# EAGLE schematic MOTOR_DRIVER (EAGLE 8.0.1)

## Sheet 1 of 4: Motor Driver Schematic
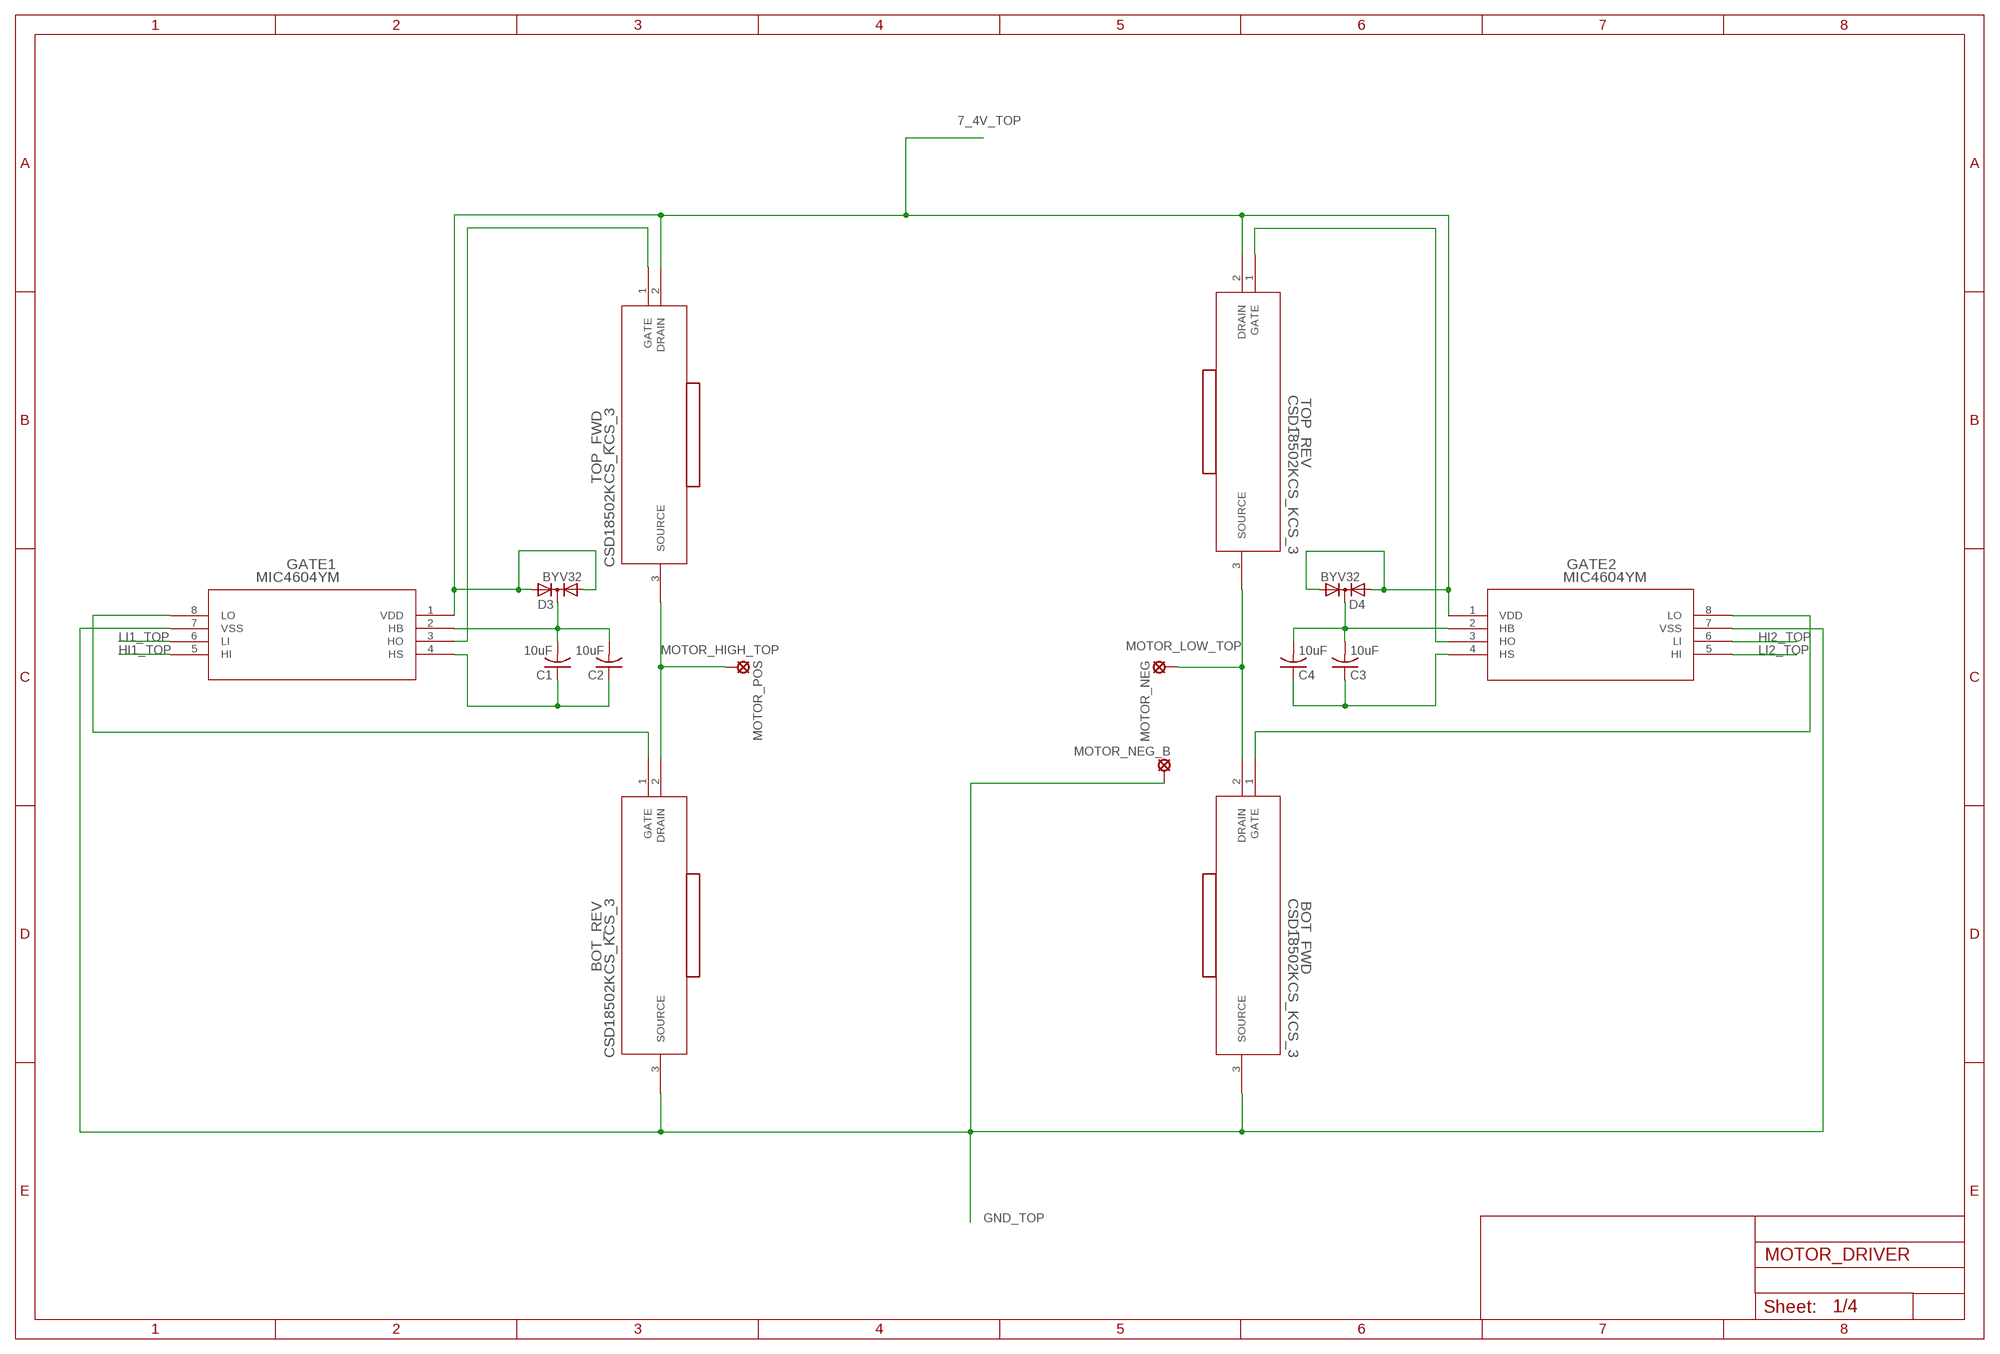
[diagram p0: schematic, sheet 1]

### Parts
BOT_FWD  CSD18502KCS_KCS_3  [KCS3]
BOT_REV  CSD18502KCS_KCS_3  [KCS3]
C1  10uF  C-US025-050X050  [C025-050X050]
C2  10uF  C-US025-050X050  [C025-050X050]
C3  10uF  C-US025-050X050  [C025-050X050]
C4  10uF  C-US025-050X050  [C025-050X050]
D3  BYV32  [TO220ABS]
D4  BYV32  [TO220ABS]
GATE1  MIC4604YM  [SOIC-8_M]
GATE2  MIC4604YM  [SOIC-8_M]
MOTOR_NEG  SE14  [SE14]
MOTOR_NEG_B  SE14  [SE14]
MOTOR_POS  SE14  [SE14]
TOP_FWD  CSD18502KCS_KCS_3  [KCS3]
TOP_REV  CSD18502KCS_KCS_3  [KCS3]
U$2  HEATSINK  [HEATSINK]
U$4  HEATSINK  [HEATSINK]
U$5  HEATSINK  [HEATSINK]
U$6  HEATSINK  [HEATSINK]

### Nets
7_4V_TOP: D3.A1 D3.A2 D4.A1 D4.A2 GATE1.1(VDD) GATE2.1(VDD) TOP_FWD.2(DRAIN) TOP_REV.2(DRAIN) ; also sheet 3,4
GND_TOP: BOT_FWD.3(SOURCE) BOT_REV.3(SOURCE) GATE1.7(VSS) GATE2.7(VSS) MOTOR_NEG_B.MP ; also sheet 3,4
HI1_TOP: GATE1.5(HI) ; also sheet 3
HI2_TOP: GATE2.6(LI) ; also sheet 3
LI1_TOP: GATE1.6(LI) ; also sheet 3
LI2_TOP: GATE2.5(HI) ; also sheet 3
MOTOR_HIGH_TOP: BOT_REV.2(DRAIN) MOTOR_POS.MP TOP_FWD.3(SOURCE) ; also sheet 3
MOTOR_LOW_TOP: BOT_FWD.2(DRAIN) MOTOR_NEG.MP TOP_REV.3(SOURCE) ; also sheet 3
N$2: BOT_REV.1(GATE) GATE1.8(LO)
N$3: GATE1.3(HO) TOP_FWD.1(GATE)
N$4: C1.1 C2.1 GATE1.4(HS)
N$5: C1.2 C2.2 D3.C GATE1.2(HB)
N$9: BOT_FWD.1(GATE) GATE2.8(LO)
N$10: GATE2.3(HO) TOP_REV.1(GATE)
N$11: C3.1 C4.1 GATE2.4(HS)
N$12: C3.2 C4.2 D4.C GATE2.2(HB)

## Sheet 2 of 4: Microcontroller schematic
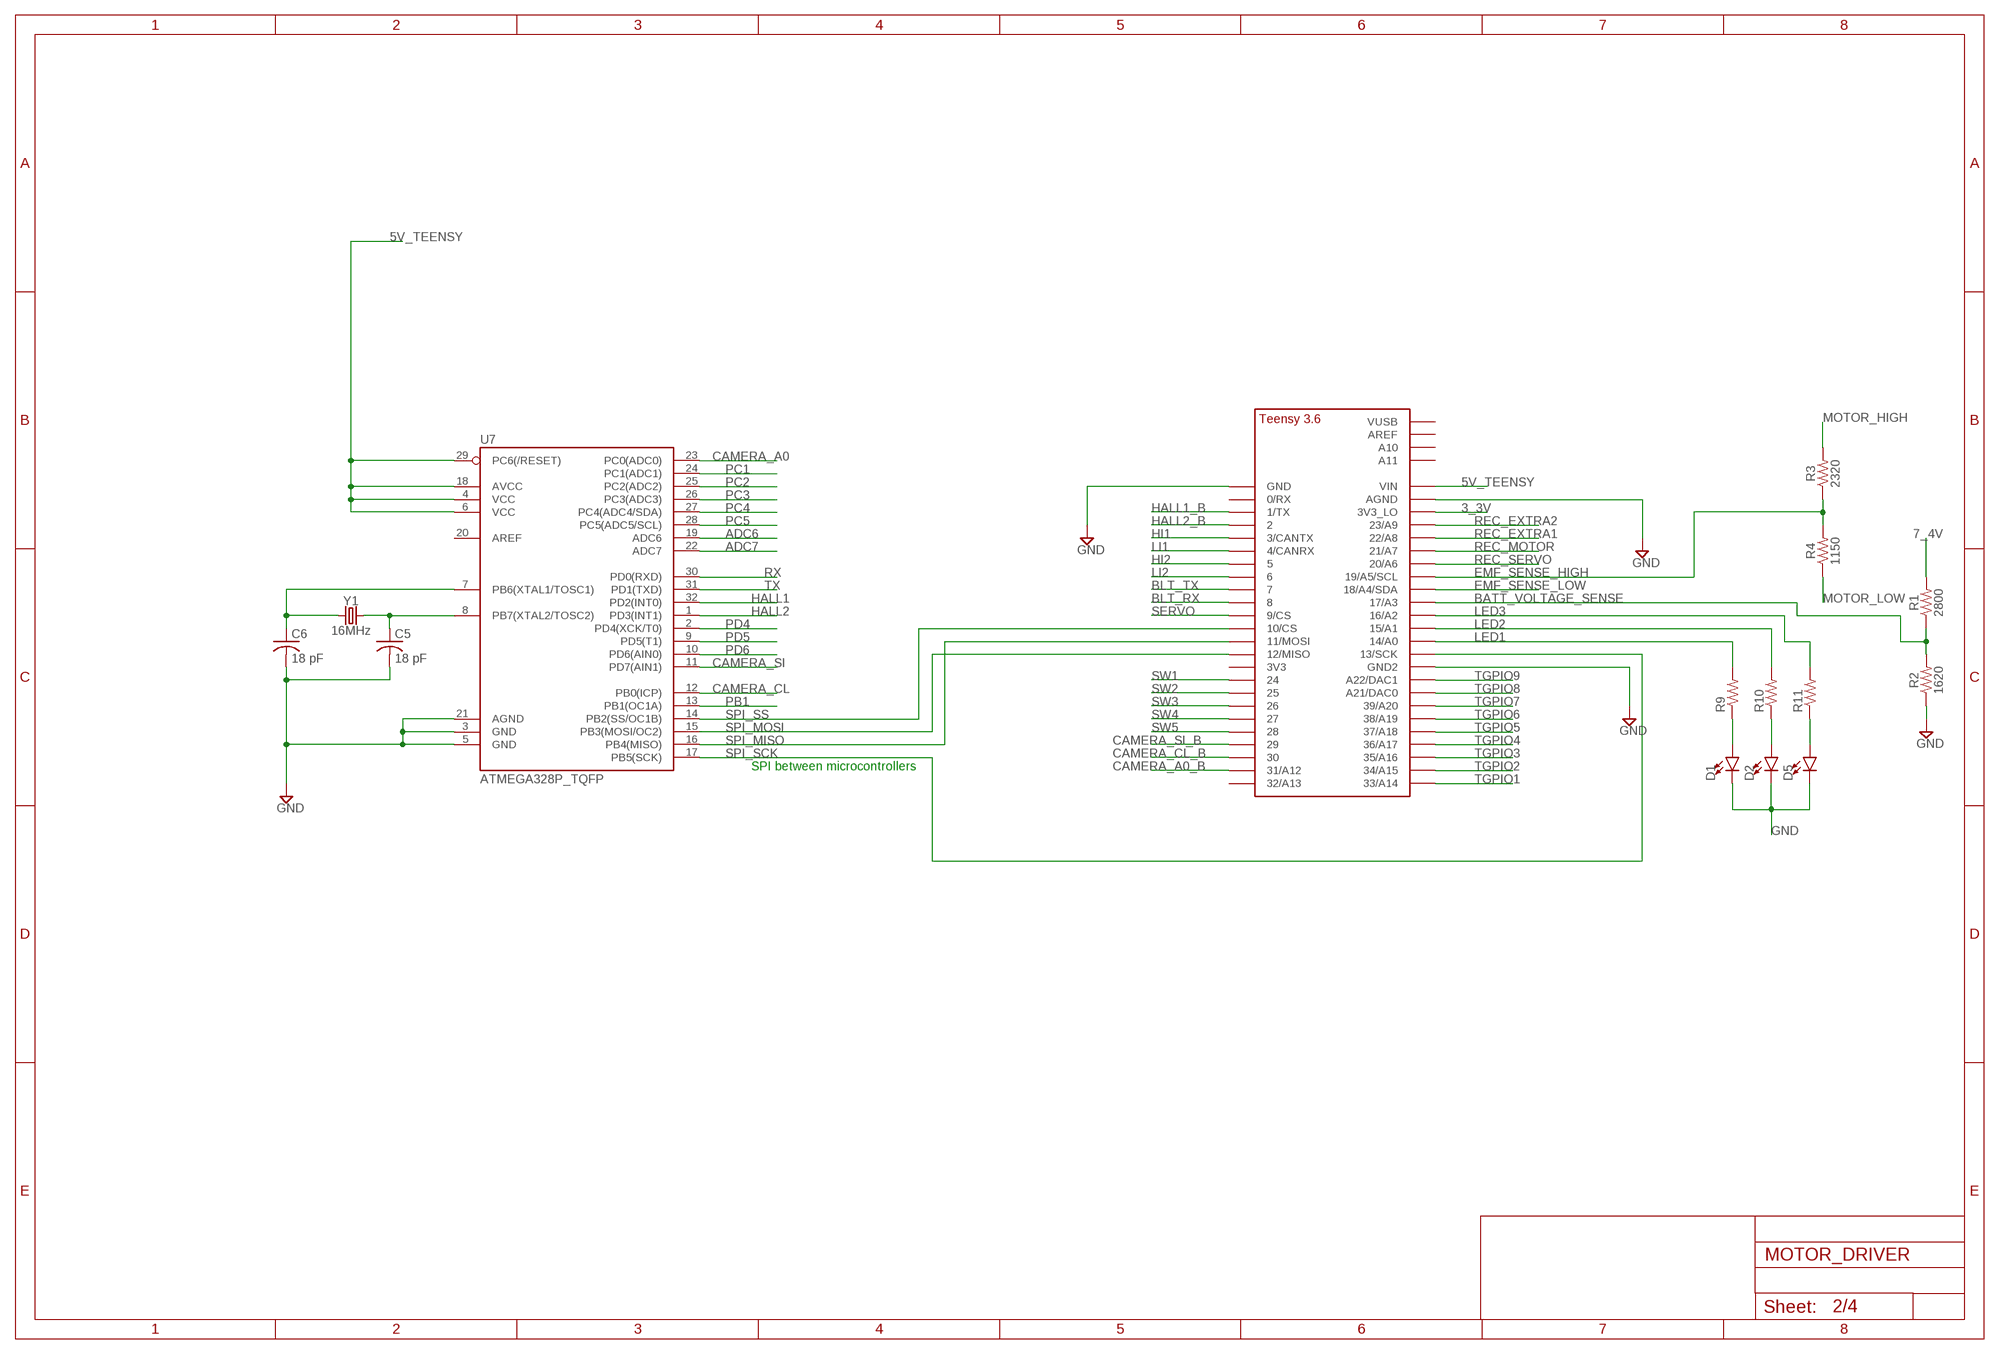
[diagram p1: schematic, sheet 2]

### Parts
C5  18 pF  C-US025-024X044  [C025-024X044]
C6  18 pF  C-US025-024X044  [C025-024X044]
D1  LED0603  [LED-0603]
D2  LED0603  [LED-0603]
D5  LED0603  [LED-0603]
R1  2800  0.3OHM-0805-1/8W-1%  [0805]
R2  1620  0.3OHM-0805-1/8W-1%  [0805]
R3  2320  0.3OHM-0805-1/8W-1%  [0805]
R4  1150  0.3OHM-0805-1/8W-1%  [0805]
R9  R-US_R0805  [R0805]
R10  R-US_R0805  [R0805]
R11  R-US_R0805  [R0805]
U7  ATMEGA328P_TQFP  [TQFP32-08]
U$1  TEENSY_3.5/3.6_BASIC  [TEENSY_3.5/3.6_BASIC]
Y1  16MHz  CRYSTAL-16MHZPTH-HC49US  [HC49US]

### Nets
3_3V: U$1.3V3_LO ; also sheet 3
5V_TEENSY: U7.4(VCC) U7.6(VCC) U7.18(AVCC) U7.29(PC6(/RESET)) U$1.VIN ; also sheet 3
7_4V: R1.2 ; also sheet 3,4
ADC6: U7.19(ADC6) ; also sheet 3
ADC7: U7.22(ADC7) ; also sheet 3
BATT_VOLTAGE_SENSE: R1.1 R2.2 U$1.17/A3
BLT_RX: U$1.8 ; also sheet 3
BLT_TX: U$1.7 ; also sheet 3
CAMERA_A0: U7.23(PC0(ADC0)) ; also sheet 3
CAMERA_A0_B: U$1.31/A12 ; also sheet 3
CAMERA_CL: U7.12(PB0(ICP)) ; also sheet 3
CAMERA_CL_B: U$1.30 ; also sheet 3
CAMERA_SI: U7.11(PD7(AIN1)) ; also sheet 3
CAMERA_SI_B: U$1.29 ; also sheet 3
EMF_SENSE_HIGH: R3.1 R4.2 U$1.19/A5/SCL
EMF_SENSE_LOW: U$1.18/A4/SDA ; also sheet 3
GND: C5.2 C6.2 D1.C D2.C D5.C R2.1 U7.3(GND) U7.5(GND) U7.21(AGND) U$1.AGND U$1.GND U$1.GND2 ; also sheet 3,4
HALL1: U7.32(PD2(INT0)) ; also sheet 3
HALL1_B: U$1.1/TX ; also sheet 3
HALL2: U7.1(PD3(INT1)) ; also sheet 3
HALL2_B: U$1.2 ; also sheet 3
HI1: U$1.3/CANTX ; also sheet 3
HI2: U$1.5 ; also sheet 3
LED1: R9.2 U$1.14/A0
LED2: R10.2 U$1.15/A1
LED3: R11.2 U$1.16/A2
LI1: U$1.4/CANRX ; also sheet 3
LI2: U$1.6 ; also sheet 3
MOTOR_HIGH: R3.2 ; also sheet 3
MOTOR_LOW: R4.1 ; also sheet 3
N$6: C6.1 U7.7(PB6(XTAL1/TOSC1)) Y1.1
N$7: C5.1 U7.8(PB7(XTAL2/TOSC2)) Y1.2
N$22: D1.A R9.1
N$23: D2.A R10.1
N$24: D5.A R11.1
PB1: U7.13(PB1(OC1A)) ; also sheet 3
PC1: U7.24(PC1(ADC1)) ; also sheet 3
PC2: U7.25(PC2(ADC2)) ; also sheet 3
PC3: U7.26(PC3(ADC3)) ; also sheet 3
PC4: U7.27(PC4(ADC4/SDA)) ; also sheet 3
PC5: U7.28(PC5(ADC5/SCL)) ; also sheet 3
PD4: U7.2(PD4(XCK/T0)) ; also sheet 3
PD5: U7.9(PD5(T1)) ; also sheet 3
PD6: U7.10(PD6(AIN0))
REC_EXTRA1: U$1.22/A8 ; also sheet 3
REC_EXTRA2: U$1.23/A9 ; also sheet 3
REC_MOTOR: U$1.21/A7 ; also sheet 3
REC_SERVO: U$1.20/A6 ; also sheet 3
RX: U7.30(PD0(RXD)) ; also sheet 3
SERVO: U$1.9/CS ; also sheet 3
SPI_MISO: U7.16(PB4(MISO)) U$1.11/MOSI
SPI_MOSI: U7.15(PB3(MOSI/OC2)) U$1.12/MISO
SPI_SCK: U7.17(PB5(SCK)) U$1.13/SCK
SPI_SS: U7.14(PB2(SS/OC1B)) U$1.10/CS
SW1: U$1.24 ; also sheet 3
SW2: U$1.25 ; also sheet 3
SW3: U$1.26 ; also sheet 3
SW4: U$1.27 ; also sheet 3
SW5: U$1.28
TGPIO1: U$1.33/A14 ; also sheet 3
TGPIO2: U$1.34/A15 ; also sheet 3
TGPIO3: U$1.35/A16 ; also sheet 3
TGPIO4: U$1.36/A17 ; also sheet 3
TGPIO5: U$1.37/A18 ; also sheet 3
TGPIO6: U$1.38/A19 ; also sheet 3
TGPIO7: U$1.39/A20 ; also sheet 3
TGPIO8: U$1.21/DAC0(A21/DAC0) ; also sheet 3
TGPIO9: U$1.A22/DAC1 ; also sheet 3
TX: U7.31(PD1(TXD)) ; also sheet 3
Unconnected: U7.20(AREF) U$1.0/RX U$1.3V3 U$1.32/A13 U$1.A10 U$1.A11 U$1.AREF U$1.VUSB

### Notes on the sheet
- SPI between microcontrollers

## Sheet 3 of 4: Header schematic
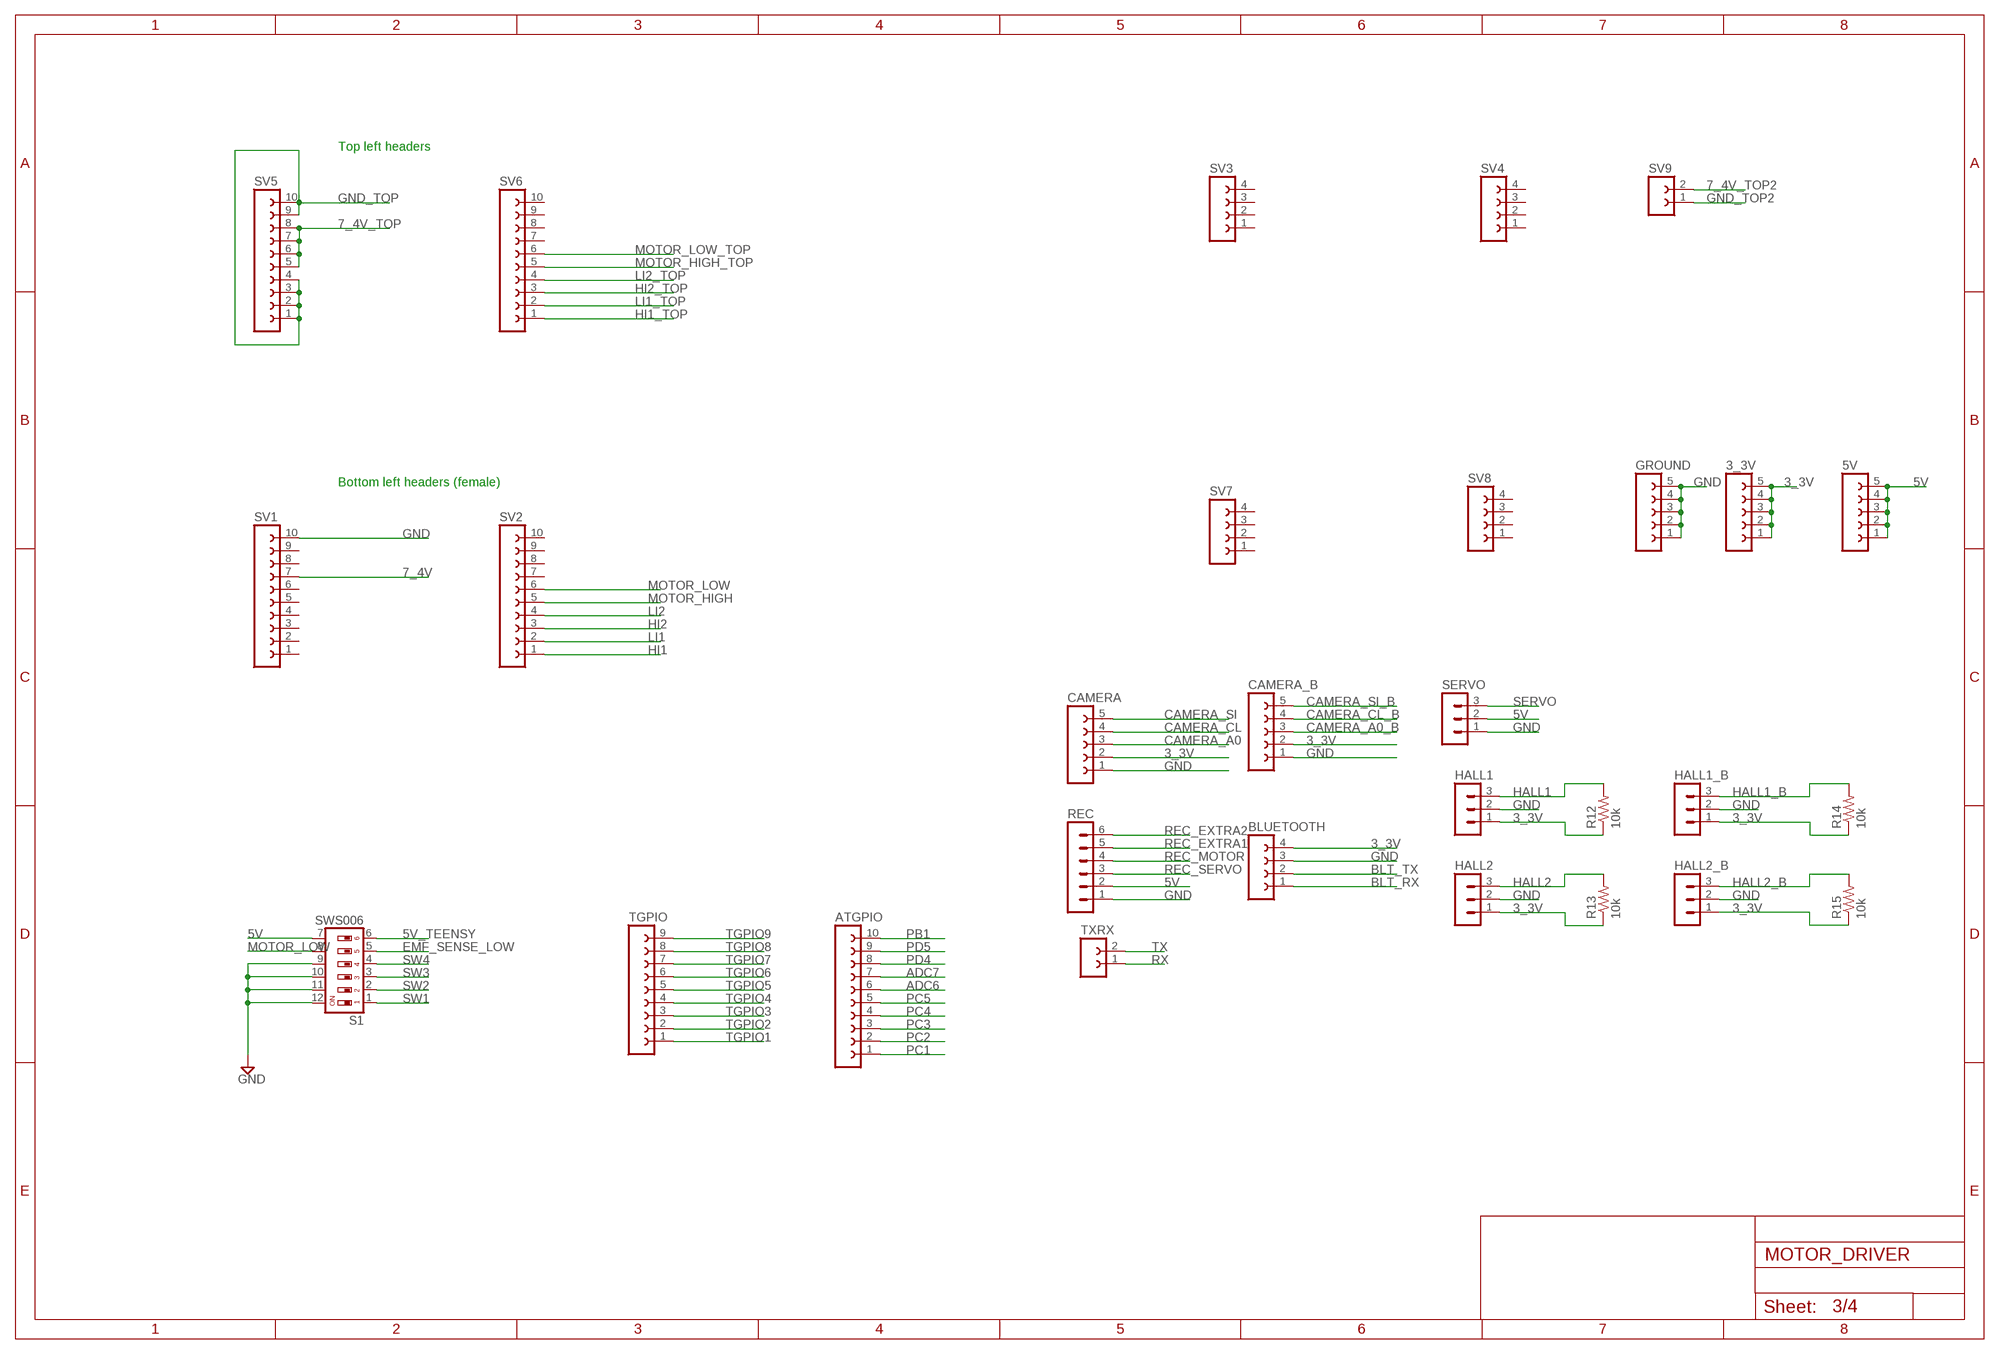
[diagram p2: schematic, sheet 3]

### Parts
3_3V  FE05-1  [FE05-1]
5V  FE05-1  [FE05-1]
ATGPIO  FE10-1  [FE10]
BLUETOOTH  FE04-1  [FE04-1]
CAMERA  FE05-1  [FE05-1]
CAMERA_B  FE05-1  [FE05-1]
GROUND  FE05-1  [FE05-1]
HALL1  MA03-1  [MA03-1]
HALL1_B  MA03-1  [MA03-1]
HALL2  MA03-1  [MA03-1]
HALL2_B  MA03-1  [MA03-1]
R12  10k  R-US_R0603  [R0603]
R13  10k  R-US_R0603  [R0603]
R14  10k  R-US_R0603  [R0603]
R15  10k  R-US_R0603  [R0603]
REC  MA06-1  [MA06-1]
S1  SWS006  [SMS-006]
SERVO  MA03-1  [MA03-1]
SV1  FE10-1  [FE10]
SV2  FE10-1  [FE10]
SV3  FE04-1  [FE04-1]
SV4  FE04-1  [FE04-1]
SV5  FE10-1  [FE10]
SV6  FE10-1  [FE10]
SV7  FE04-1  [FE04-1]
SV8  FE04-1  [FE04-1]
SV9  FE02-1  [FE02-1]
TGPIO  FE09-1  [FE09]
TXRX  FE02-1  [FE02-1]

### Nets
3_3V: 3_3V.1 3_3V.2 3_3V.3 3_3V.4 3_3V.5 BLUETOOTH.4 CAMERA.2 CAMERA_B.2 HALL1.1 HALL1_B.1 HALL2.1 HALL2_B.1 R12.1 R13.1 R14.1 R15.1 ; also sheet 2
5V: 5V.1 5V.2 5V.3 5V.4 5V.5 REC.2 S1.7 SERVO.2 ; also sheet 4
5V_TEENSY: S1.6 ; also sheet 2
7_4V: SV1.7 ; also sheet 2,4
7_4V_TOP: SV5.5 SV5.6 SV5.7 SV5.8 ; also sheet 1,4
7_4V_TOP2: SV9.2 ; also sheet 4
ADC6: ATGPIO.6 ; also sheet 2
ADC7: ATGPIO.7 ; also sheet 2
BLT_RX: BLUETOOTH.1 ; also sheet 2
BLT_TX: BLUETOOTH.2 ; also sheet 2
CAMERA_A0: CAMERA.3 ; also sheet 2
CAMERA_A0_B: CAMERA_B.3 ; also sheet 2
CAMERA_CL: CAMERA.4 ; also sheet 2
CAMERA_CL_B: CAMERA_B.4 ; also sheet 2
CAMERA_SI: CAMERA.5 ; also sheet 2
CAMERA_SI_B: CAMERA_B.5 ; also sheet 2
EMF_SENSE_LOW: S1.5 ; also sheet 2
GND: BLUETOOTH.3 CAMERA.1 CAMERA_B.1 GROUND.1 GROUND.2 GROUND.3 GROUND.4 GROUND.5 HALL1.2 HALL1_B.2 HALL2.2 HALL2_B.2 REC.1 S1.9 S1.10 S1.11 S1.12 SERVO.1 SV1.10 ; also sheet 2,4
GND_TOP: SV5.1 SV5.2 SV5.3 SV5.4 SV5.9 SV5.10 ; also sheet 1,4
GND_TOP2: SV9.1 ; also sheet 4
HALL1: HALL1.3 R12.2 ; also sheet 2
HALL1_B: HALL1_B.3 R14.2 ; also sheet 2
HALL2: HALL2.3 R13.2 ; also sheet 2
HALL2_B: HALL2_B.3 R15.2 ; also sheet 2
HI1: SV2.1 ; also sheet 2
HI1_TOP: SV6.1 ; also sheet 1
HI2: SV2.3 ; also sheet 2
HI2_TOP: SV6.3 ; also sheet 1
LI1: SV2.2 ; also sheet 2
LI1_TOP: SV6.2 ; also sheet 1
LI2: SV2.4 ; also sheet 2
LI2_TOP: SV6.4 ; also sheet 1
MOTOR_HIGH: SV2.5 ; also sheet 2
MOTOR_HIGH_TOP: SV6.5 ; also sheet 1
MOTOR_LOW: S1.8 SV2.6 ; also sheet 2
MOTOR_LOW_TOP: SV6.6 ; also sheet 1
PB1: ATGPIO.10 ; also sheet 2
PC1: ATGPIO.1 ; also sheet 2
PC2: ATGPIO.2 ; also sheet 2
PC3: ATGPIO.3 ; also sheet 2
PC4: ATGPIO.4 ; also sheet 2
PC5: ATGPIO.5 ; also sheet 2
PD4: ATGPIO.8 ; also sheet 2
PD5: ATGPIO.9 ; also sheet 2
REC_EXTRA1: REC.5 ; also sheet 2
REC_EXTRA2: REC.6 ; also sheet 2
REC_MOTOR: REC.4 ; also sheet 2
REC_SERVO: REC.3 ; also sheet 2
RX: TXRX.1 ; also sheet 2
SERVO: SERVO.3 ; also sheet 2
SW1: S1.1 ; also sheet 2
SW2: S1.2 ; also sheet 2
SW3: S1.3 ; also sheet 2
SW4: S1.4 ; also sheet 2
TGPIO1: TGPIO.1 ; also sheet 2
TGPIO2: TGPIO.2 ; also sheet 2
TGPIO3: TGPIO.3 ; also sheet 2
TGPIO4: TGPIO.4 ; also sheet 2
TGPIO5: TGPIO.5 ; also sheet 2
TGPIO6: TGPIO.6 ; also sheet 2
TGPIO7: TGPIO.7 ; also sheet 2
TGPIO8: TGPIO.8 ; also sheet 2
TGPIO9: TGPIO.9 ; also sheet 2
TX: TXRX.2 ; also sheet 2
Unconnected: SV1.1 SV1.2 SV1.3 SV1.4 SV1.5 SV1.6 SV1.8 SV1.9 SV2.7 SV2.8 SV2.9 SV2.10 SV3.1 SV3.2 SV3.3 SV3.4 SV4.1 SV4.2 SV4.3 SV4.4 SV6.7 SV6.8 SV6.9 SV6.10 SV7.1 SV7.2 SV7.3 SV7.4 SV8.1 SV8.2 SV8.3 SV8.4

### Notes on the sheet
- Top left headers
- Bottom left headers (female)

## Sheet 4 of 4: Power Schematic
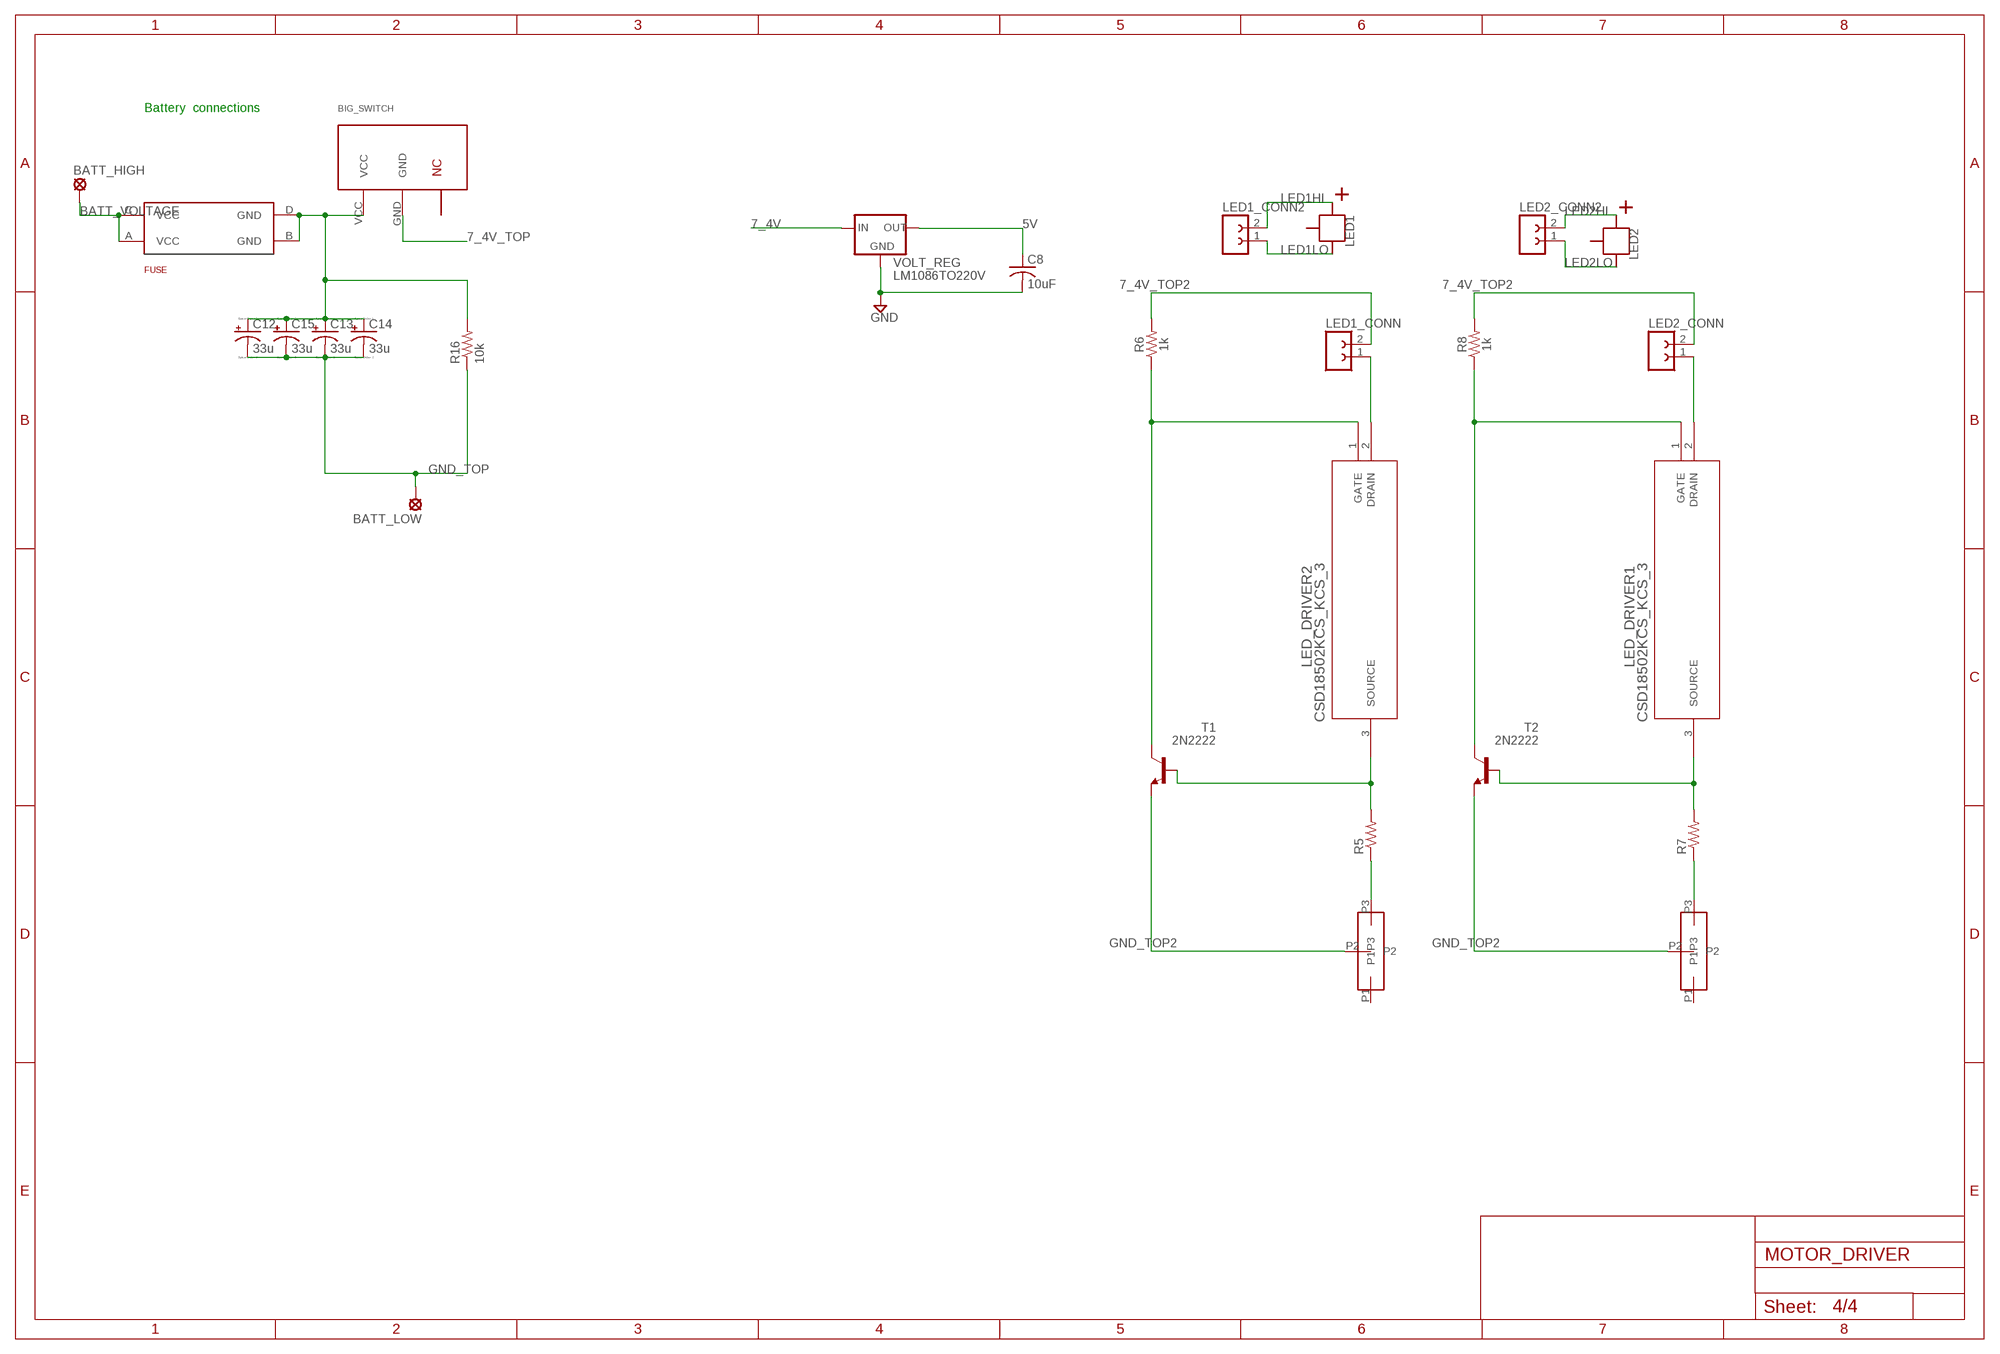
[diagram p3: schematic, sheet 4]

### Parts
BATT_HIGH  SE14  [SE14]
BATT_LOW  SE14  [SE14]
BIG_SWITCH  BIGSWITCH  [BIGSWITCH]
C8  10uF  C-US050-025X075  [C050-025X075]
C12  33u  CPOL-US153CLV-1010  [153CLV-1010]
C13  33u  CPOL-US153CLV-1010  [153CLV-1010]
C14  33u  CPOL-US153CLV-1010  [153CLV-1010]
C15  33u  CPOL-US153CLV-1010  [153CLV-1010]
FUSE  FUSEHOLDER3588  [FUSEHOLDER3588]
LED1  CREE_XP  [XP]
LED1_CONN  FE02-1  [FE02-1]
LED1_CONN2  FE02-1  [FE02-1]
LED2  CREE_XP  [XP]
LED2_CONN  FE02-1  [FE02-1]
LED2_CONN2  FE02-1  [FE02-1]
LED_DRIVER1  CSD18502KCS_KCS_3  [KCS3]
LED_DRIVER2  CSD18502KCS_KCS_3  [KCS3]
R5  R-US_R2512  [R2512]
R6  1k  1KOHM-HORIZ-1/4W-1%  [AXIAL-0.3]
R7  R-US_R2512  [R2512]
R8  1k  1KOHM-HORIZ-1/4W-1%  [AXIAL-0.3]
R16  10k  R-US_R0603  [R0603]
T1  2N2222  [TO18]
T2  2N2222  [TO18]
U$3  POT  [POT]
U$7  POT  [POT]
VOLT_REG  LM1086TO220V  [TO220S]

### Nets
5V: C8.1 VOLT_REG.2(OUT) ; also sheet 3
7_4V: VOLT_REG.3(IN) ; also sheet 2,3
7_4V_TOP: BIG_SWITCH.GND ; also sheet 1,3
7_4V_TOP2: LED1_CONN.2 LED2_CONN.2 R6.P$2 R8.P$2 ; also sheet 3
BATT_VOLTAGE: BATT_HIGH.MP FUSE.A(VCC) FUSE.C(VCC)
GND: C8.2 VOLT_REG.1(GND) ; also sheet 2,3
GND_TOP: BATT_LOW.MP C12.- C13.- C14.- C15.- R16.1 ; also sheet 1,3
GND_TOP2: T1.1(E) T2.1(E) U$3.P2 U$7.P2 ; also sheet 3
LED1HI: LED1.POSITIVE LED1.POSITIVE1(POSITIVE) LED1_CONN2.2
LED1LO: LED1.NEGATIVE LED1.NEGATIVE1(NEGATIVE) LED1_CONN2.1
LED2HI: LED2.POSITIVE LED2.POSITIVE1(POSITIVE) LED2_CONN2.2
LED2LO: LED2.NEGATIVE LED2.NEGATIVE1(NEGATIVE) LED2_CONN2.1
N$1: R5.1 U$7.P3
N$8: LED_DRIVER2.3(SOURCE) R5.2 T1.2(B)
N$13: R7.1 U$3.P3
N$16: LED_DRIVER2.1(GATE) R6.P$1 T1.3(C)
N$17: LED1_CONN.1 LED_DRIVER2.2(DRAIN)
N$18: LED_DRIVER1.3(SOURCE) R7.2 T2.2(B)
N$19: LED_DRIVER1.1(GATE) R8.P$1 T2.3(C)
N$20: LED2_CONN.1 LED_DRIVER1.2(DRAIN)
N$21: BIG_SWITCH.VCC C12.+ C13.+ C14.+ C15.+ FUSE.B(GND) FUSE.D(GND) R16.2
Unconnected: LED1.THERMAL LED2.THERMAL U$3.P1 U$7.P1

### Notes on the sheet
- Battery  connections

## Library data of the parts
3_3V 5V CAMERA CAMERA_B GROUND = con-lsta:FE05-1: FEMALE HEADER; OC_FARNELL: unknown; OC_NEWARK: unknown
ATGPIO SV1 SV2 SV5 SV6 = con-lsta:FE10-1: FEMALE HEADER; OC_FARNELL: unknown; OC_NEWARK: unknown
BATT_HIGH BATT_LOW MOTOR_NEG MOTOR_NEG_B MOTOR_POS = solpad:SE14: SOLDER PAD E1553, drill 1,4mm, distributor Buerklin, 07F820
BIG_SWITCH = bigswitch:BIGSWITCH
BLUETOOTH SV3 SV4 SV7 SV8 = con-lsta:FE04-1: FEMALE HEADER
BOT_FWD BOT_REV LED_DRIVER1 LED_DRIVER2 TOP_FWD TOP_REV = CSD18502KCS:CSD18502KCS_KCS_3; MANUFACTURER_PART_NUMBER: csd18502kcs_kcs_3; VENDOR: TEXAS INSTRUMENTS
C1-C6 C8 = resistor:C-US: CAPACITOR, American symbol
C12-C15 = resistor:CPOL-US: POLARIZED CAPACITOR, American symbol
D1 D2 D5 = SparkFun-LED:LED: LED (Generic) Standard schematic elements and footprints for 5mm, 3mm, 1206, and 0603 sized LEDs. Generic LEDs with no color specified.
D3 D4 = diode:BYV32: DIODE 2 x Si diode 200 V, 20 A/230 Apeak, 25 ns
FUSE = minifuse:FUSEHOLDER3588: Fuseholder for Keystone 3588 mini fuse
GATE1 GATE2 = MIC4604:MIC4604YM; MANUFACTURER_PART_NUMBER: mic4604ym; VENDOR: Microchip
HALL1 HALL1_B HALL2 HALL2_B SERVO = con-lstb:MA03-1: PIN HEADER; OC_FARNELL: unknown; OC_NEWARK: unknown
LED1 LED2 = Cree_XP:CREE_XP
LED1_CONN LED1_CONN2 LED2_CONN LED2_CONN2 SV9 TXRX = con-lsta:FE02-1: FEMALE HEADER
R1-R4 = SparkFun-Resistors:0.3OHM: 0.3Ω resistor A resistor is a passive two-terminal electrical component that implements electrical resistance as a circuit element. Resistors act to reduce current flow, and, at the same time, act to lower voltage levels within circuits. - Wikipedia; PROD_ID: RES-11622; VALUE: 0.3
R5 R7 R9-R11 = rcl:R-US_: RESISTOR, American symbol
R6 R8 = SparkFun-Resistors:1KOHM: 1kΩ resistor A resistor is a passive two-terminal electrical component that implements electrical resistance as a circuit element. Resistors act to reduce current flow, and, at the same time, act to lower voltage levels within circuits. - Wikipedia; PROD_ID: RES-12182
R12-R16 = resistor:R-US_: RESISTOR, American symbol
REC = con-lstb:MA06-1: PIN HEADER; OC_FARNELL: unknown; OC_NEWARK: unknown
S1 = smd-special:SWS006: SMD Dip Switch 6 pol.
T1 T2 = transistor:2N2222: NPN TRANSISTOR
TGPIO = con-lsta:FE09-1: FEMALE HEADER; OC_FARNELL: unknown; OC_NEWARK: unknown
U7 = SparkFun-IC-Microcontroller:ATMEGA328P_TQFP: Popular 328P in QFP Storefront component: ATmega328 - TQFP <https://www.sparkfun.com/products/13448> (COM-13448) Datasheet <http://www.sparkfun.com/datasheets/Components/SMD/ATMega328.pdf> SparkFun Products SparkFun RedBoard - Programmed with Arduino <https://www.sparkfun.com/products/12757> (DEV-12757) Arduino Pro Mini 328 - 5V/16MHz <https://www.sparkfun.com/products/11113> (DEV-11113) Arduino Pro Mini 328 - 3.3V/8MHz <https://www.sparkfun.com/products/11114> (DEV-11114) SparkFun OpenLog <https://www.sparkfun.com/products/13712> (DEV-13712) SparkFun MicroView - OLED Arduino Module <https://www.sparkfun.com/products/12923> (DEV-12923) SparkFun Digital Sandbox <https://www.sparkfun.com/products/12651> (DEV-12651) SparkFun PicoBoard <https://www.sparkfun.com/products/11888> (WIG-11888) Arduino Fio <https://www.sparkfun.com/products/10116> (DEV-10116) LilyPad Arduino 328 Main Board <https://www.sparkfun.com/products/13342> (DEV-13342) SparkFun RedStick <https://www.sparkfun.com/products/13741> (DEV-13741) LilyPad MP3 <https://www.sparkfun.com/products/11013> (DEV-11013) LilyPad Arduino SimpleSnap <https://www.sparkfun.com/products/10941> (DEV-10941) SparkFun Stepoko <https://www.sparkfun.com/products/13899> (ROB-13899) SparkFun Geiger Counter <https://www.sparkfun.com/products/11345> (SEN-11345) SparkFun EL Sequencer <https://www.sparkfun.com/products/12781> (COM-12781) Arduino Pro 328 - 5V/16MHz <https://www.sparkfun.com/products/10915> (DEV-10915) CryptoCape <https://www.sparkfun.com/products/12773> (DEV-12773) SparkFun IR Thermometer Evaluation Board - MLX90614 <https://www.sparkfun.com/products/10740> (SEN-10740) SparkFun RedBot Mainboard <https://www.sparkfun.com/products/12097> (ROB-12097) Arduino Pro 328 - 3.3V/8MHz <https://www.sparkfun.com/products/10914> (DEV-10914) SparkFun Block for Intel® Edison - Arduino <https://www.sparkfun.com/products/13036> (DEV-13036) SparkFun Simon Says - Surface Mount Soldering Kit <https://www.sparkfun.com/products/10935> (KIT-10935) SparkFun 7-Segment Serial Display - Red <https://www.sparkfun.com/products/11441> (COM-11441) SparkFun 7-Segment Serial Display - White <https://www.sparkfun.com/products/11629> (COM-11629) SparkFun 7-Segment Serial Display - Yellow <https://www.sparkfun.com/products/11443> (COM-11443) SparkFun 7-Segment Serial Display - Kelly Green <https://www.sparkfun.com/products/11440> (COM-11440) SparkFun 7-Segment Serial Display - Blue <https://www.sparkfun.com/products/11442> (COM-11442) SparkFun OpenSegment Serial Display - 20mm (Blue) <https://www.sparkfun.com/products/11647> (COM-11647) SparkFun OpenSegment Serial Display - 20mm (Green) <https://www.sparkfun.com/products/11646> (COM-11646) SparkFun OpenSegment Serial Display - 20mm (White) <https://www.sparkfun.com/products/11648> (COM-11648) SparkFun OpenSegment Serial Display - 20mm (Red) <https://www.sparkfun.com/products/11644> (COM-11644) SparkFun OpenSegment Serial Display - 20mm (Yellow) <https://www.sparkfun.com/products/11645> (COM-11645) SparkFun OpenSegment Shield <https://www.sparkfun.com/products/13190> (DEV-13190); PROD_ID: IC-09069
U$1 = Teensy356:TEENSY_3.5/3.6_BASIC
U$2 U$4-U$6 = heatsink:HEATSINK
U$3 U$7 = ledpot:POT
VOLT_REG = v-reg-3:LM1086
Y1 = SparkFun-Clocks:CRYSTAL-16MHZ: 16MHz Crystal Digikey Example <http://www.digikey.com/product-search/en?keywords=535-9122-1-ND> Frequency: 16MHz Frequency Stability: ±50ppm Frequency Tolerance: ±20ppm Load Capacitance: 18pF SparkFun Products: Pro Micro -5V/16MHz <https://www.sparkfun.com/products/12640> SparkFun Serial Enabled LCD Kit <https://www.sparkfun.com/products/10097>; PROD_ID: XTAL-08181; SF_ID: COM-00536